# Altium schematic sheet SW 12.schdoc
size 349 x 127 mm; SheetNumber: 1; SheetTotal: 1
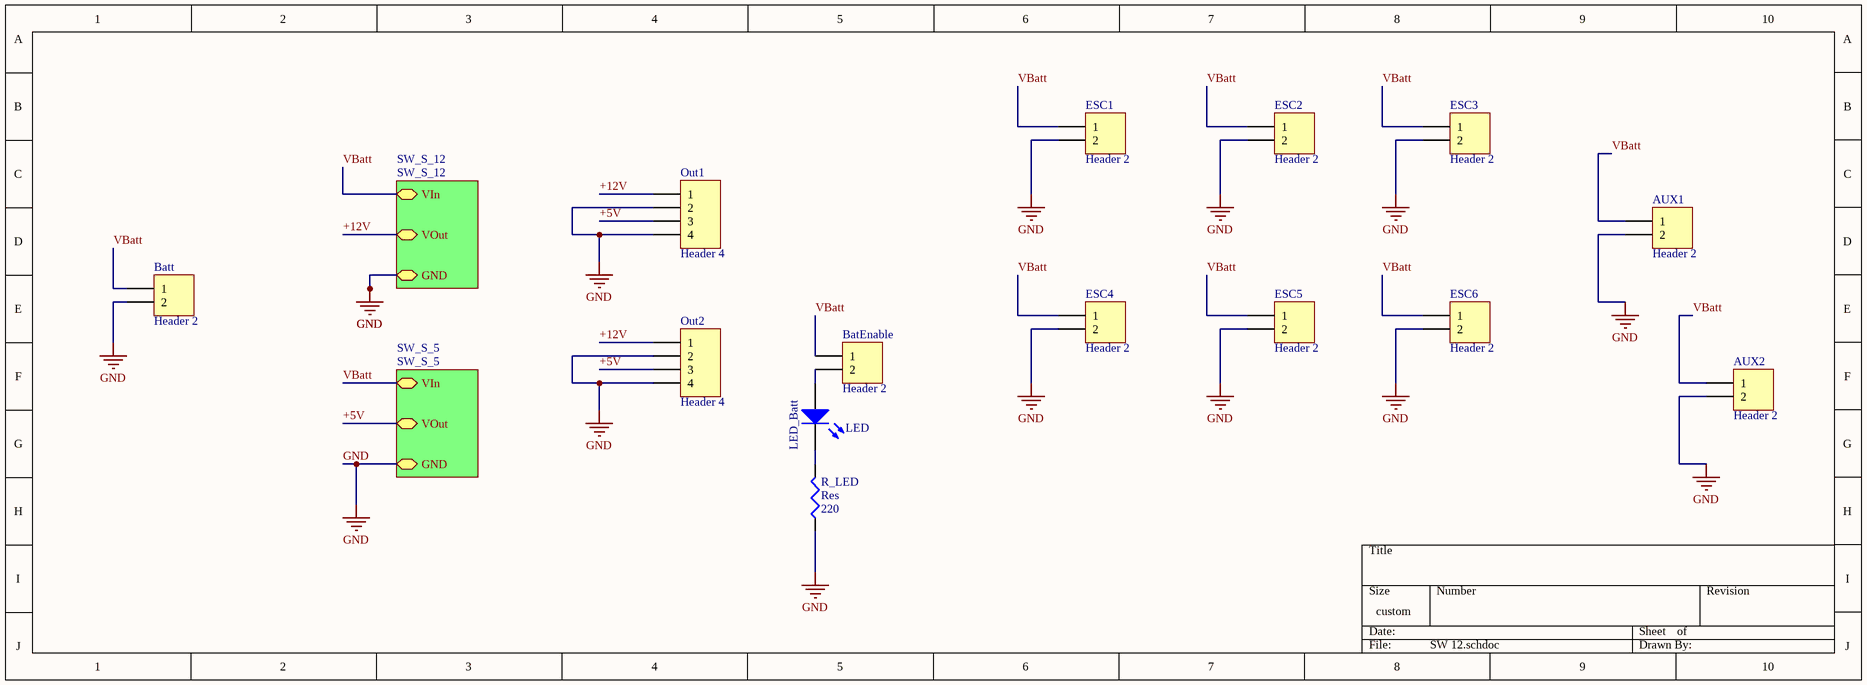
[diagram p0: SW 12.schdoc]

## Parts
AUX1  Header 2  [14 AWG Power Footprint]
AUX2  Header 2  [14 AWG Power Footprint]
BatEnable  Header 2  [HDR1X2]
Batt  Header 2  [10 AWG Power Footprint]
ESC1  Header 2  [14 AWG Power Footprint]
ESC2  Header 2  [14 AWG Power Footprint]
ESC3  Header 2  [14 AWG Power Footprint]
ESC4  Header 2  [14 AWG Power Footprint]
ESC5  Header 2  [14 AWG Power Footprint]
ESC6  Header 2  [14 AWG Power Footprint]
LED_Batt  LED  [6-0805_L]
Out1  Header 4  [HDR1X4]
Out2  Header 4  [HDR1X4]
R_LED  Res  value 220  [6-0805_L]

## Sub-sheets
SW_S_5 = SW_S_5: VIn, GND, VOut
SW_S_12 = SW_S_12: VIn, GND, VOut

## Nets
GND: AUX1.2 AUX2.2 Batt.2 ESC1.2 ESC2.2 ESC3.2 ESC4.2 ESC5.2 ESC6.2 Out1.2 Out1.4 Out2.2 Out2.4 R_LED.1 ; sheet SW_S_12/GND, sheet SW_S_5/GND
+5V: Out1.3 Out2.3 ; sheet SW_S_5/VOut
+12V: Out1.1 Out2.1 ; sheet SW_S_12/VOut
VBatt: AUX1.1 AUX2.1 BatEnable.1 Batt.1 ESC1.1 ESC2.1 ESC3.1 ESC4.1 ESC5.1 ESC6.1 ; sheet SW_S_12/VIn, sheet SW_S_5/VIn
NetBatEnable_2: BatEnable.2 LED_Batt.1(A)
NetLED_Batt_2: LED_Batt.2(K) R_LED.2

## Library data of the parts
AUX1 AUX2 BatEnable Batt ESC1-ESC6 = Header 2: Header, 2-Pin; LatestRevisionDate: 17-Jul-2002; LatestRevisionNote: Re-released for DXP Platform.; Publisher: Altium Limited
LED_Batt = LED2: Typical RED, GREEN, YELLOW, AMBER GaAs LED; Published: 8-Jun-2000; LatestRevisionDate: 17-Jul-2002; LatestRevisionNote: Re-released for DXP Platform.; PackageVersion: Feb-2002; PackageReference: 3.2X1.6X1.1; Publisher: Altium Limited; PackageDescription: SM LED; 2 Flat Leads
Out1 Out2 = Header 4: Header, 4-Pin; LatestRevisionDate: 17-Jul-2002; LatestRevisionNote: Re-released for DXP Platform.; Publisher: Altium Limited
R_LED = Res3: Resistor; Published: 8-Jun-2000; LatestRevisionDate: 29-May-2009; LatestRevisionNote: IPC-7351 Footprint Added.; PackageReference: J1-0603; Publisher: Altium Limited; PackageDescription: Chip Resistor